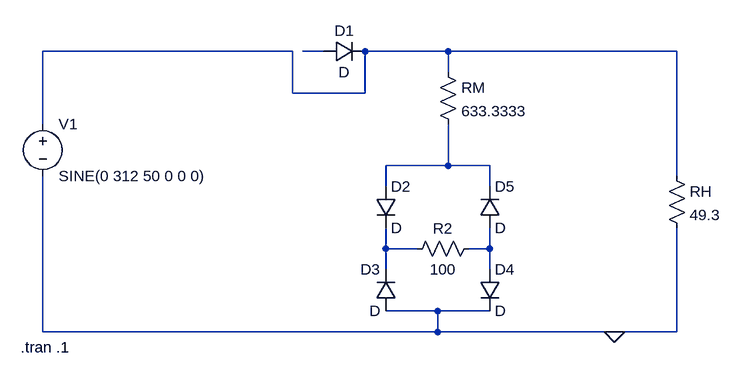
[diagram p0: schematic ej3tp1 eee.asc]
ej3tp1 eee.asc, the LTspice schematic file:
Version 4
SHEET 1 1148 680
WIRE 480 16 96 16
WIRE 528 16 496 16
WIRE 720 16 592 16
WIRE 1072 16 720 16
WIRE 720 48 720 16
WIRE 480 80 480 16
WIRE 592 80 592 16
WIRE 592 80 480 80
WIRE 96 128 96 16
WIRE 720 192 720 128
WIRE 720 192 624 192
WIRE 784 192 720 192
WIRE 1072 208 1072 16
WIRE 624 224 624 192
WIRE 784 224 784 192
WIRE 624 320 624 288
WIRE 672 320 624 320
WIRE 784 320 784 288
WIRE 784 320 752 320
WIRE 624 352 624 320
WIRE 784 352 784 320
WIRE 704 416 624 416
WIRE 784 416 704 416
WIRE 96 448 96 208
WIRE 704 448 704 416
WIRE 704 448 96 448
WIRE 976 448 704 448
WIRE 1072 448 1072 288
WIRE 1072 448 976 448
FLAG 976 448 0
SYMBOL voltage 96 112 R0
WINDOW 123 0 0 Left 0
WINDOW 39 0 0 Left 0
SYMATTR InstName V1
SYMATTR Value SINE(0 312 50 0 0 0)
SYMBOL diode 528 32 R270
WINDOW 0 32 32 VTop 2
WINDOW 3 0 32 VBottom 2
SYMATTR InstName D1
SYMBOL res 704 32 R0
SYMATTR InstName RM
SYMATTR Value 633.3333
SYMBOL diode 608 224 R0
SYMATTR InstName D2
SYMBOL diode 640 416 R180
WINDOW 0 24 64 Left 2
WINDOW 3 24 0 Left 2
SYMATTR InstName D3
SYMBOL diode 768 352 R0
SYMATTR InstName D4
SYMBOL diode 768 288 M180
WINDOW 0 24 64 Left 2
WINDOW 3 24 0 Left 2
SYMATTR InstName D5
SYMBOL res 768 304 R90
WINDOW 0 0 56 VBottom 2
WINDOW 3 32 56 VTop 2
SYMATTR InstName R2
SYMATTR Value 100
SYMBOL res 1056 192 R0
SYMATTR InstName RH
SYMATTR Value 49.3
TEXT 62 472 Left 2 !.tran .1

The netlist it stands for:
* ej3tp1 eee.asc
V1 N001 0 SINE(0 312 50 0 0 0)
D1 N002 N001 D
RM N001 N003 633.3333
D2 N003 N004 D
D3 0 N004 D
D4 N005 0 D
D5 N005 N003 D
R2 N005 N004 100
RH N001 0 49.3
.model D D
.lib standard.dio
.tran .1
.backanno
.end